# EAGLE design untitled (EAGLE 7.5.0)
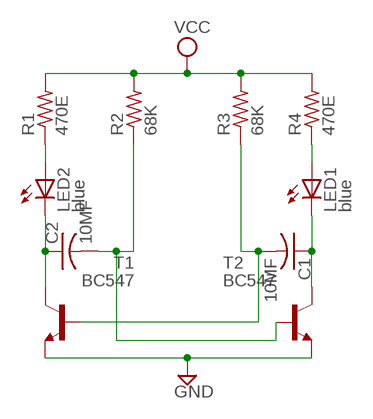
[diagram p0: schematic, sheet 1]

## Parts
C1  10MF  C-US050-024X044  [C050-024X044]
C2  10MF  C-US050-024X044  [C050-024X044]
LED1  blue  LED5MM  [LED5MM]
LED2  blue  LED5MM  [LED5MM]
R1  470E  R-US_0207/10  [0207/10]
R2  68K  R-US_0207/10  [0207/10]
R3  68K  R-US_0207/10  [0207/10]
R4  470E  R-US_0207/10  [0207/10]
T1  BC547  [TO92]
T2  BC547  [TO92]

## Nets
GND: T1.1(E) T2.1(E)
N$2: LED2.A R1.1
N$3: C2.1 LED2.K(C) T1.3(C)
N$5: C1.1 LED1.K(C) T2.3(C)
N$6: LED1.A R4.1
N$7: C2.2 R2.1 T2.2(B)
N$8: C1.2 R3.1 T1.2(B)
VCC: R1.2 R2.2 R3.2 R4.2

## Library data of the parts
C1 C2 = rcl:C-US: CAPACITOR, American symbol
LED1 LED2 = led:LED: LED OSRAM: - CHIPLED LG R971, LG N971, LY N971, LG Q971, LY Q971, LO R971, LY R971 LH N974, LH R974 LS Q976, LO Q976, LY Q976 LO Q996 - Hyper CHIPLED LW Q18S LB Q993, LB Q99A, LB R99A - SideLED LS A670, LO A670, LY A670, LG A670, LP A670 LB A673, LV A673, LT A673, LW A673 LH A674 LY A675 LS A676, LA A676, LO A676, LY A676, LW A676 LS A679, LY A679, LG A679 - Hyper Micro SIDELED® LS Y876, LA Y876, LO Y876, LY Y876 LT Y87S - SmartLED LW L88C, LW L88S LB L89C, LB L89S, LG L890 LS L89K, LO L89K, LY L89K LS L896, LA L896, LO L896, LY L896 - TOPLED LS T670, LO T670, LY T670, LG T670, LP T670 LSG T670, LSP T670, LSY T670, LOP T670, LYG T670 LG T671, LOG T671, LSG T671 LB T673, LV T673, LT T673, LW T673 LH T674 LS T676, LA T676, LO T676, LY T676, LB T676, LH T676, LSB T676, LW T676 LB T67C, LV T67C, LT T67C, LS T67K, LO T67K, LY T67K, LW E67C LS E67B, LA E67B, LO E67B, LY E67B, LB E67C, LV E67C, LT E67C LW T67C LS T679, LY T679, LG T679 LS T770, LO T770, LY T770, LG T770, LP T770 LB T773, LV T773, LT T773, LW T773 LH T774 LS E675, LA E675, LY E675, LS T675 LS T776, LA T776, LO T776, LY T776, LB T776 LHGB T686 LT T68C, LB T68C - Hyper Mini TOPLED® LB M676 - Mini TOPLED Santana® LG M470 LS M47K, LO M47K, LY M47K Source: http://www.osram.convergy.de LUXEON: - LUMILED® LXK2-PW12-R00, LXK2-PW12-S00, LXK2-PW14-U00, LXK2-PW14-V00 LXK2-PM12-R00, LXK2-PM12-S00, LXK2-PM14-U00 LXK2-PE12-Q00, LXK2-PE12-R00, LXK2-PE12-S00, LXK2-PE14-T00, LXK2-PE14-U00 LXK2-PB12-K00, LXK2-PB12-L00, LXK2-PB12-M00, LXK2-PB14-N00, LXK2-PB14-P00, LXK2-PB14-Q00 LXK2-PR12-L00, LXK2-PR12-M00, LXK2-PR14-Q00, LXK2-PR14-R00 LXK2-PD12-Q00, LXK2-PD12-R00, LXK2-PD12-S00 LXK2-PH12-R00, LXK2-PH12-S00 LXK2-PL12-P00, LXK2-PL12-Q00, LXK2-PL12-R00 Source: www.luxeon.com KINGBRIGHT: KA-3528ASYC Source: www.kingbright.com
R1-R4 = rcl:R-US_: RESISTOR, American symbol
T1 T2 = transistor:BC547: NPN TRANSISTOR

## Board
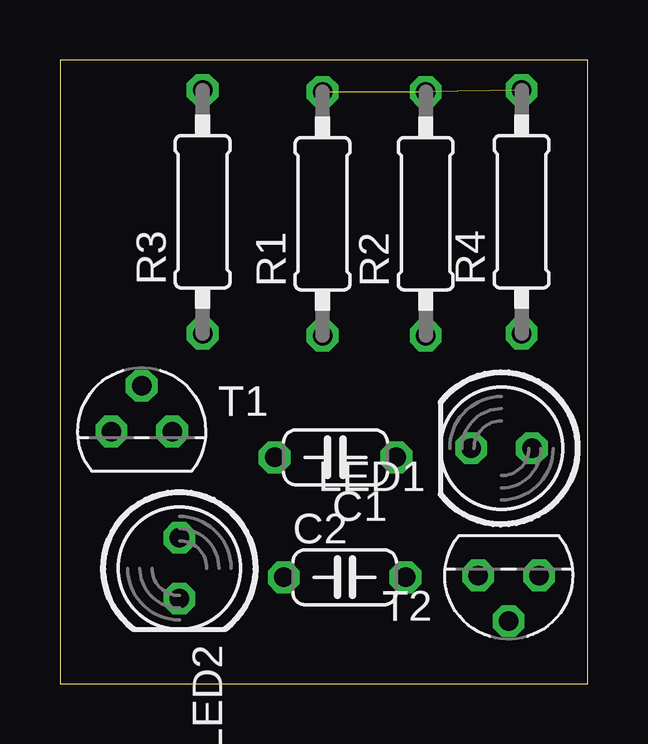
[diagram p1: board, top side]
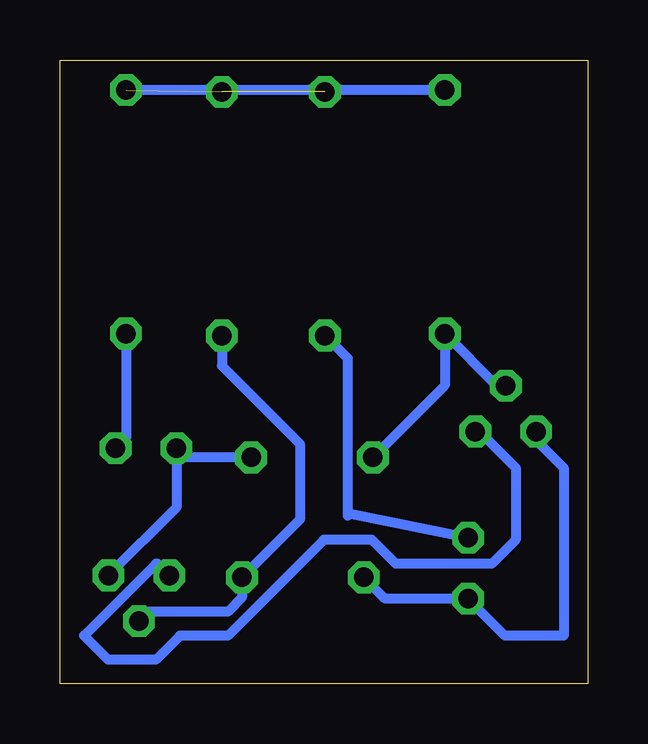
[diagram p2: board, bottom side, seen from below]

Size 22 x 26 mm. Coordinates in mm from the lower left corner, seen from the top.
Outline: 0,0 22,0 22,26 0,26 0,0
Copper layers (1*16): Top 0.035mm / dielectric 1.5mm / Bottom 0.035mm
Design rules "default": minimum track width 10mil, minimum drill 24mil, track to track 8mil, track to pad 8mil, pad to pad 8mil, via to via 8mil, smd to smd 8mil, copper to edge 40mil, drill to drill 8mil, minimum pad ring 10mil, minimum via ring 8mil, stop-mask expansion 4mil, vias tented up to drill 0mil, thermal gap 10mil

### Footprints (pad centres in the part's own frame; a part is rotated, then mirrored left to right if it is on the bottom)
C050-024X044 = drill 0.813 octagon: 1 -2.54,0; 2 2.54,0
LED5MM = drill 0.813 octagon: A -1.27,0; K 1.27,0
0207/10 = drill 0.813 octagon: 1 -5.08,0; 2 5.08,0
TO92 = drill 0.813 octagon: 1 1.27,0; 2 0,1.905; 3 -1.27,0

### Placement (x,y rotation side)
C1  11.49,9.43 180 top
C2  11.87,4.43 0 top
LED1  18.41,9.81 180 top
LED2  4.98,4.81 270 top
R1  10.95,19.59 90 top
R2  15.25,19.59 90 top
R3  5.95,19.67 90 top
R4  19.25,19.67 90 top
T1  3.41,10.51 0 top
T2  18.71,4.51 180 top

### Tracks (layer width: path | path; a pad name or v marks a point on that pad's centre or on a via)
GND
  Bottom 0.406: T1.1 4.51,10.51 3,9 3,6 4,5 8,5 9,6 11,6 15,2 17,2 18,1 20,1 21,2 18,5 17.93,5 T2.1
N$2
  Bottom 0.406: LED2.A 9.92,7.08 10,7 10,13.56 R1.1
N$3
  Bottom 0.406: C2.1 8.44,3.54 LED2.K 3.44,2 1,2 1,9 2.14,10.14 T1.3
N$5
  Bottom 0.406: C1.1 16.76,9.43 LED1.K 17.14,7.35 T2.3
N$6
  Bottom 0.406: R4.1 19.25,10.24 LED1.A
N$7
  Bottom 0.406: R2.1 15.25,13.25 12,10 12,6.84 C2.2 14.41,3.59 15,3 18.32,3 T2.2
N$8
  Bottom 0.406: C1.2 5.95,12.43 R3.1 3.78,12.41 T1.2
VCC  (2 unrouted)
  Bottom 0.406: R3.2 R4.2